# EAGLE design RetroBit (EAGLE 7.2.0)
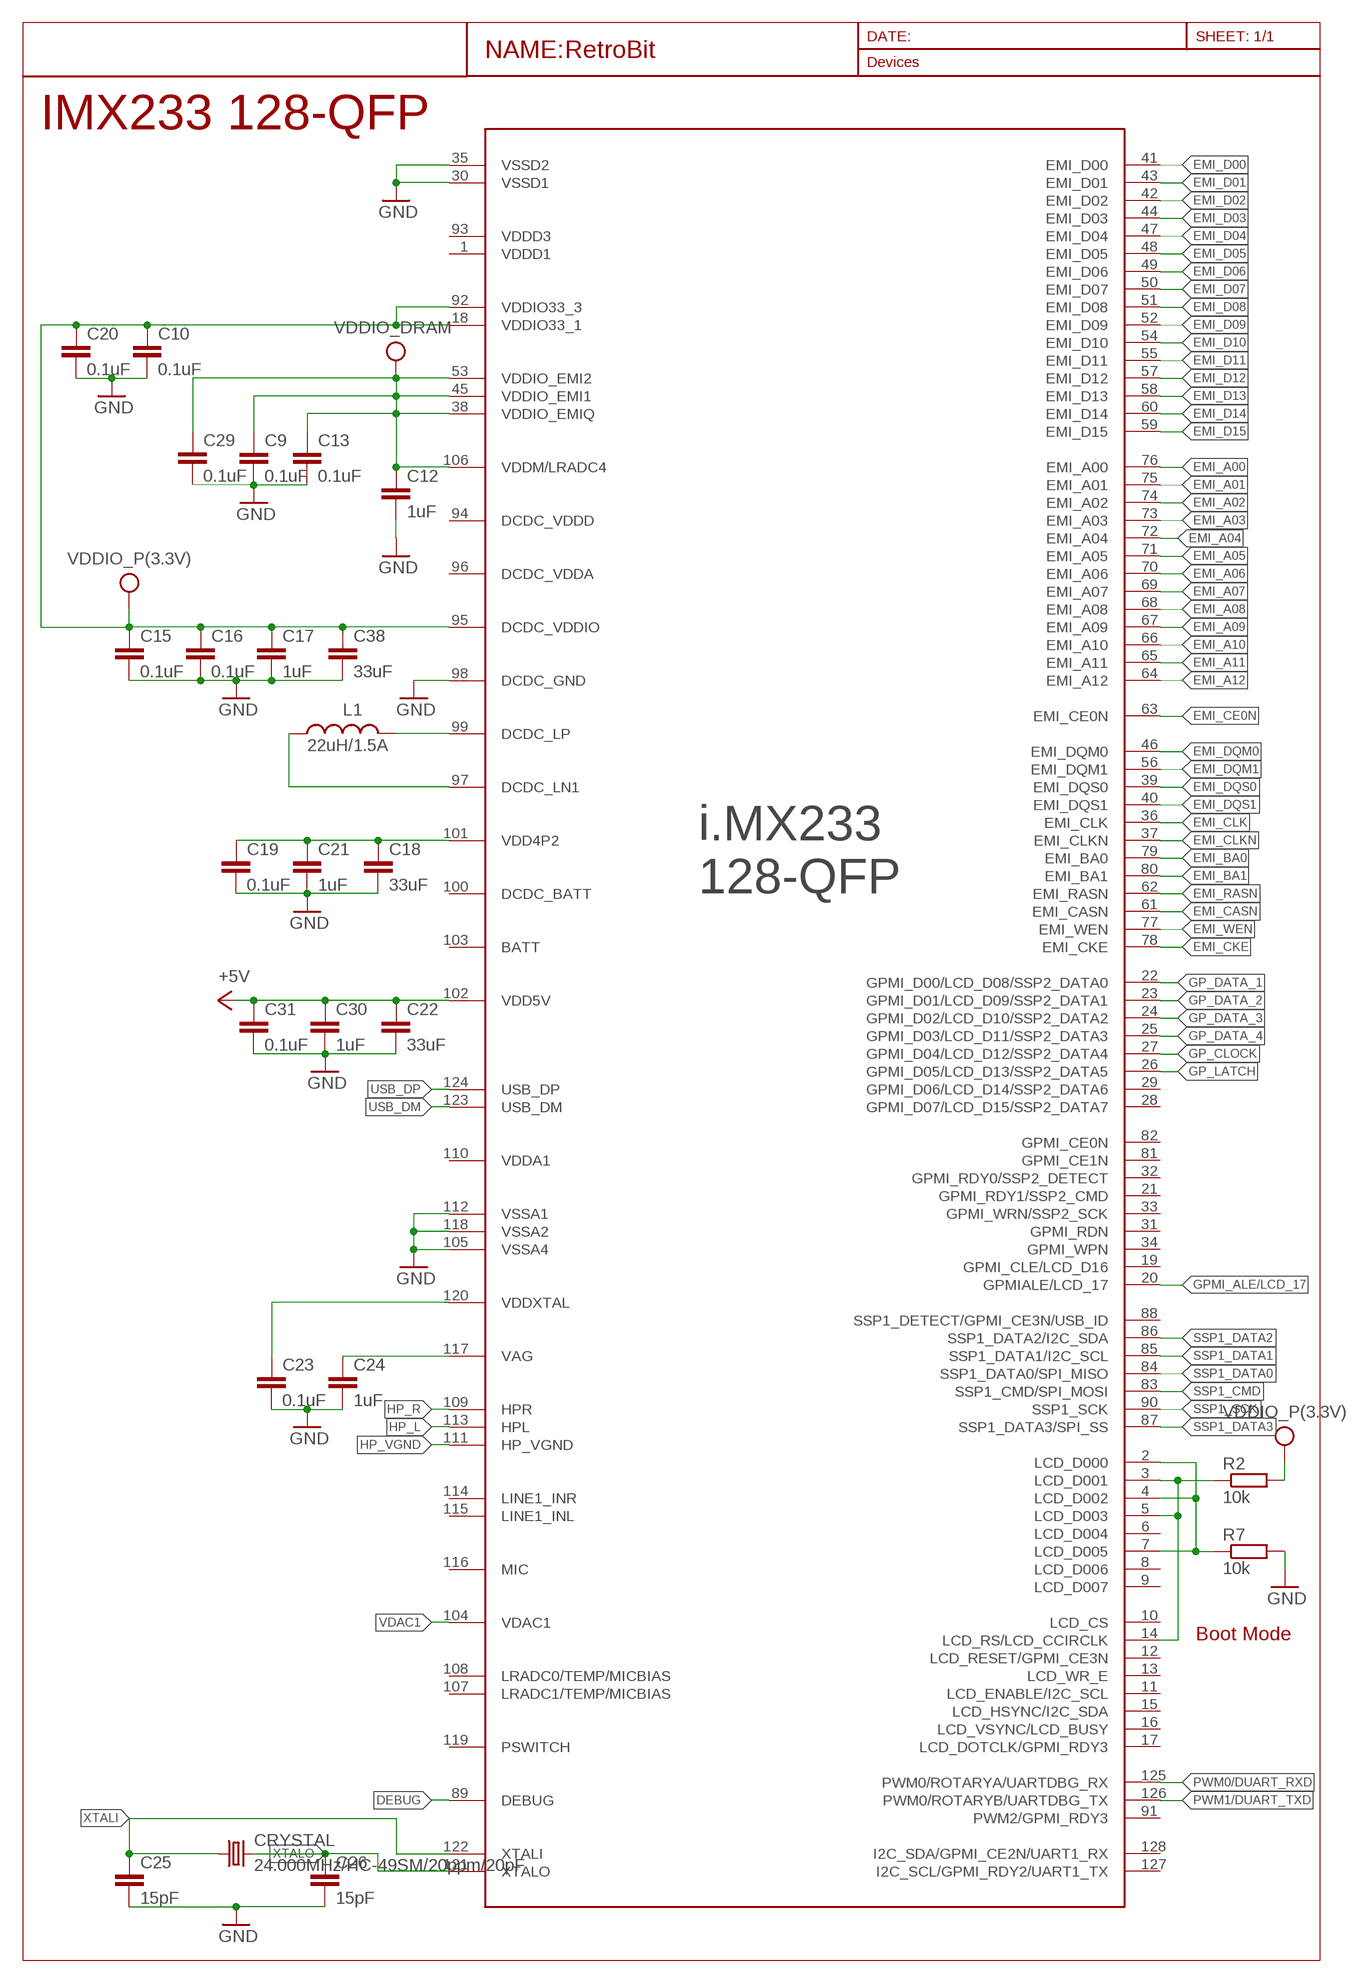
[diagram p0: schematic, sheet 1, part 1 of 2]
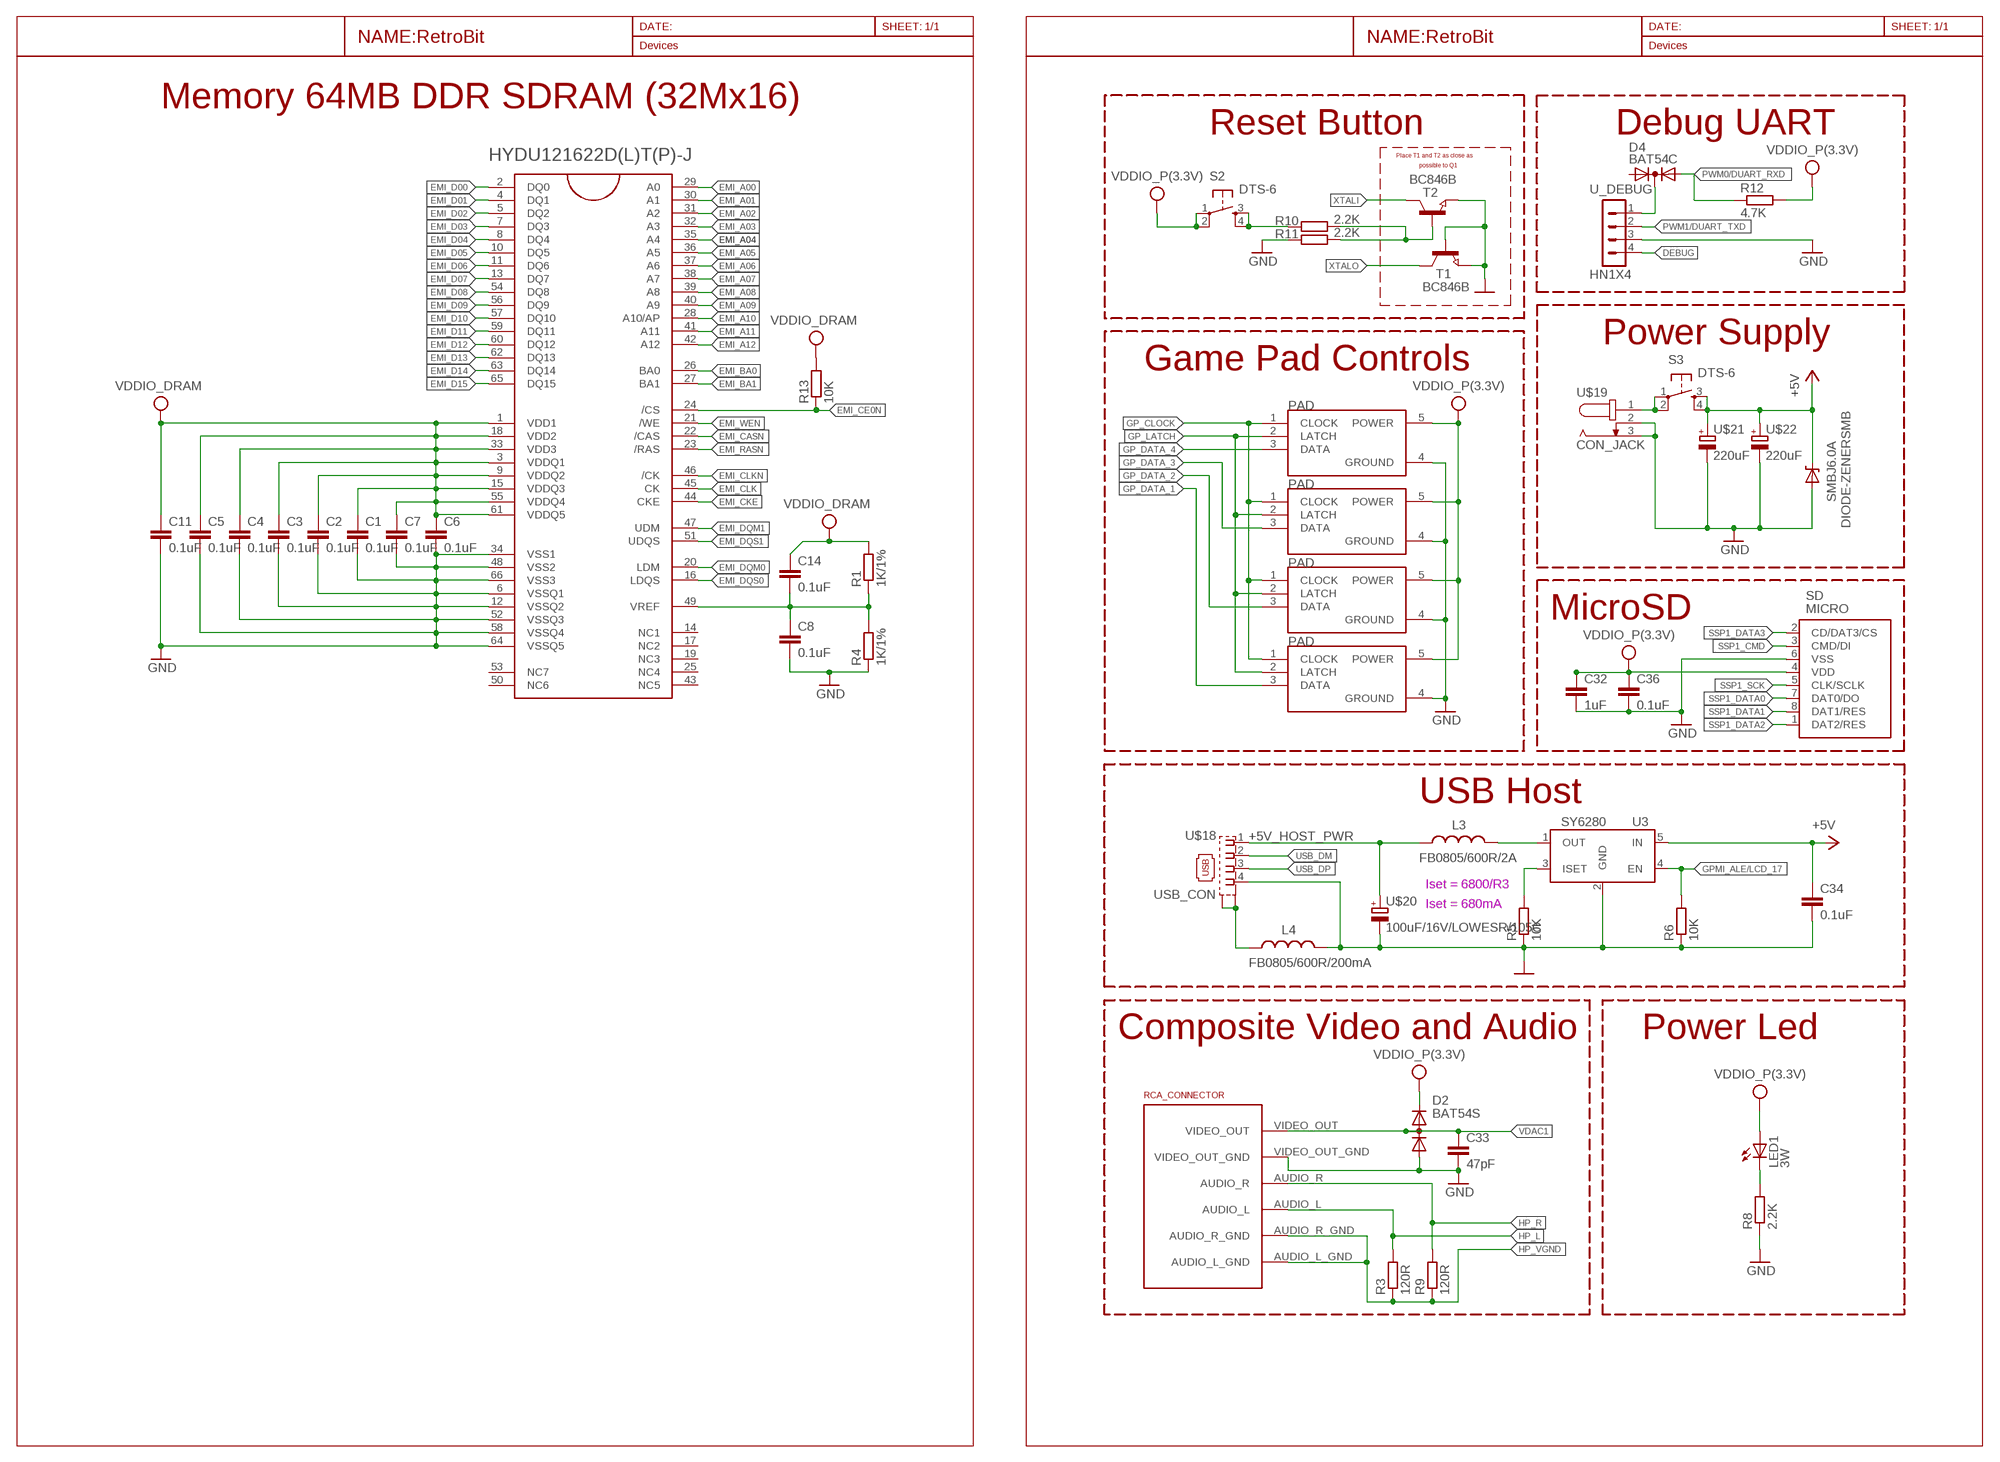
[diagram p1: schematic, sheet 1, part 2 of 2]

## Parts
C1  0.1uF  C-EUC0603K  [C0603K]
C2  0.1uF  C-EUC0603K  [C0603K]
C3  0.1uF  C-EUC0603K  [C0603K]
C4  0.1uF  C-EUC0603K  [C0603K]
C5  0.1uF  C-EUC0603K  [C0603K]
C6  0.1uF  C-EUC0603K  [C0603K]
C7  0.1uF  C-EUC0603K  [C0603K]
C8  0.1uF  C-EUC0603K  [C0603K]
C9  0.1uF  C-EUC0603K  [C0603K]
C10  0.1uF  C-EUC0603K  [C0603K]
C11  0.1uF  C-EUC0603K  [C0603K]
C12  1uF  C-EUC0805K  [C0805K]
C13  0.1uF  C-EUC0603K  [C0603K]
C14  0.1uF  C-EUC0603K  [C0603K]
C15  0.1uF  C-EUC0603K  [C0603K]
C16  0.1uF  C-EUC0603K  [C0603K]
C17  1uF  C-EUC0805K  [C0805K]
C18  33uF  C-EUC1210K  [C1210K]
C19  0.1uF  C-EUC0603K  [C0603K]
C20  0.1uF  C-EUC0603K  [C0603K]
C21  1uF  C-EUC0805K  [C0805K]
C22  33uF  C-EUC1210K  [C1210K]
C23  0.1uF  C-EUC0603K  [C0603K]
C24  1uF  C-EUC0805K  [C0805K]
C25  15pF  C-EUC0603K  [C0603K]
C26  15pF  C-EUC0603K  [C0603K]
C29  0.1uF  C-EUC0603K  [C0603K]
C30  1uF  C-EUC0805K  [C0805K]
C31  0.1uF  C-EUC0603K  [C0603K]
C32  1uF  C-EUC0805K  [C0805K]
C33  47pF  C-EUC0603K  [C0603K]
C34  0.1uF  C-EUC0603K  [C0603K]
C36  0.1uF  C-EUC0603K  [C0603K]
C38  33uF  C-EUC1210K  [C1210K]
CRYSTAL  24.000MHz/HC-49SM/20ppm/20pF  HC49U-V  [HC49U-V]
D2  BAT54S  DIODE_AC-AC_  [SOT23C(BAT54S)]
D4  BAT54C  DIODE_AC-CA_  [SOT23C]
IC1  MCIMX233CAG4C  [MCIMX233CAG4C]
L1  22uH/1.5A  INDUCTORCR75  [CR75]
L3  FB0805/600R/2A  INDUCTOR0805  [0805]
L4  FB0805/600R/200mA  INDUCTOR0805  [0805]
LED1  3W  LED3MM  [LED3MM]
R1  1K/1%  R-EU_R0603  [R0603]
R2  10k  R-EU_R0603  [R0603]
R3  120R  R-EU_R0805  [R0805]
R4  1K/1%  R-EU_R0603  [R0603]
R5  10K  R-EU_R0805  [R0805]
R6  10K  R-EU_R0805  [R0805]
R7  10k  R-EU_R0603  [R0603]
R8  2.2K  R-EU_R0805  [R0805]
R9  120R  R-EU_R0805  [R0805]
R10  2.2K  R-EU_R0805  [R0805]
R11  2.2K  R-EU_R0805  [R0805]
R12  4.7K  R-EU_R0805  [R0805]
R13  10K  R-EU_R0805  [R0805]
RCA_CONNECTOR  RCA_CONNECTOR  [RCA_CONNECTOR]
S2  DTS-6  [DTS-6]
S3  DTS-6  [DTS-6]
SD  MICRO  MICRO_SD/MMC  [TFR-MEM-CON]
SMBJ6.0A  DIODE-ZENERSMB  [SMB-DIODE]
T1  BC846B  NPN-TRANSISTOR_SOT23  [SOT23]
T2  BC846B  NPN-TRANSISTOR_SOT23  [SOT23]
U3  SY6280  [SOT23-5]
U$1  HY5DU121622D  [HYDU121622D(L)T(P)-J]
U$3  GAME_PAD  [GAME_PAD]
U$8  GAME_PAD  [GAME_PAD]
U$9  GAME_PAD  [GAME_PAD]
U$14  GAME_PAD  [GAME_PAD]
U$18  USB_CON  [USB_CON]
U$19  CON_JACK  [CON_JACK]
U$20  100uF/16V/LOWESR/105C  CPOL-EVE2.5-6.3  [CPOL-EVE-2.5,6-3]
U$21  220uF  CPOL-EVE2.5-6.3  [CPOL-EVE-2.5,6-3]
U$22  220uF  CPOL-EVE2.5-6.3  [CPOL-EVE-2.5,6-3]
U_DEBUG  HN1X4  CON4HN1X4  [HN1X4]

## Nets
+5V: C22.1 C30.1 C31.1 C34.1 IC1.102(VDD5V) S3.3 S3.4 SMBJ6.0A.C U3.5(IN) U$21.+ U$22.+
+5V_HOST_PWR: L3.1 U$18.1 U$20.+
DEBUG: IC1.89(DEBUG) U_DEBUG.4
EMI_A00: IC1.76(EMI_A00) U$1.29(A0)
EMI_A01: IC1.75(EMI_A01) U$1.30(A1)
EMI_A02: IC1.74(EMI_A02) U$1.31(A2)
EMI_A03: IC1.73(EMI_A03) U$1.32(A3)
EMI_A04: IC1.72(EMI_A04) U$1.35(A4)
EMI_A05: IC1.71(EMI_A05) U$1.36(A5)
EMI_A06: IC1.70(EMI_A06) U$1.37(A6)
EMI_A07: IC1.69(EMI_A07) U$1.38(A7)
EMI_A08: IC1.68(EMI_A08) U$1.39(A8)
EMI_A09: IC1.67(EMI_A09) U$1.40(A9)
EMI_A10: IC1.66(EMI_A10) U$1.28(A10/AP)
EMI_A11: IC1.65(EMI_A11) U$1.41(A11)
EMI_A12: IC1.64(EMI_A12) U$1.42(A12)
EMI_BA0: IC1.79(EMI_BA0) U$1.26(BA0)
EMI_BA1: IC1.80(EMI_BA1) U$1.27(BA1)
EMI_CASN: IC1.61(EMI_CASN) U$1.22(/CAS)
EMI_CE0N: IC1.63(EMI_CE0N) R13.1 U$1.24(/CS)
EMI_CKE: IC1.78(EMI_CKE) U$1.44(CKE)
EMI_CLK: IC1.36(EMI_CLK) U$1.45(CK)
EMI_CLKN: IC1.37(EMI_CLKN) U$1.46(/CK)
EMI_D00: IC1.41(EMI_D00) U$1.2(DQ0)
EMI_D01: IC1.43(EMI_D01) U$1.4(DQ1)
EMI_D02: IC1.42(EMI_D02) U$1.5(DQ2)
EMI_D03: IC1.44(EMI_D03) U$1.7(DQ3)
EMI_D04: IC1.47(EMI_D04) U$1.8(DQ4)
EMI_D05: IC1.48(EMI_D05) U$1.10(DQ5)
EMI_D06: IC1.49(EMI_D06) U$1.11(DQ6)
EMI_D07: IC1.50(EMI_D07) U$1.13(DQ7)
EMI_D08: IC1.51(EMI_D08) U$1.54(DQ8)
EMI_D09: IC1.52(EMI_D09) U$1.56(DQ9)
EMI_D10: IC1.54(EMI_D10) U$1.57(DQ10)
EMI_D11: IC1.55(EMI_D11) U$1.59(DQ11)
EMI_D12: IC1.57(EMI_D12) U$1.60(DQ12)
EMI_D13: IC1.58(EMI_D13) U$1.62(DQ13)
EMI_D14: IC1.60(EMI_D14) U$1.63(DQ14)
EMI_D15: IC1.59(EMI_D15) U$1.65(DQ15)
EMI_DQM0: IC1.46(EMI_DQM0) U$1.20(LDM)
EMI_DQM1: IC1.56(EMI_DQM1) U$1.47(UDM)
EMI_DQS0: IC1.39(EMI_DQS0) U$1.16(LDQS)
EMI_DQS1: IC1.40(EMI_DQS1) U$1.51(UDQS)
EMI_RASN: IC1.62(EMI_RASN) U$1.23(/RAS)
EMI_WEN: IC1.77(EMI_WEN) U$1.21(/WE)
GND: C1.2 C2.2 C3.2 C4.2 C5.2 C6.2 C7.2 C8.2 C9.2 C10.2 C11.2 C12.2 C13.2 C15.2 C16.2 C17.2 C18.2 C19.2 C20.2 C21.2 C22.2 C23.2 C24.2 C25.2 C26.2 C29.2 C30.2 C31.2 C32.2 C33.2 C34.2 C36.2 C38.2 D2.1(A) IC1.30(VSSD1) IC1.35(VSSD2) IC1.98(DCDC_GND) IC1.105(VSSA4) IC1.112(VSSA1) IC1.118(VSSA2) L4.2 R4.1 R5.1 R6.1 R7.2 R8.1 R11.1 RCA_CONNECTOR.VIDEO_OUT_GND SD.6(VSS) SMBJ6.0A.A T1.1(B) T1.2(E) T2.2(E) U3.2(GND) U$1.6(VSSQ1) U$1.12(VSSQ2) U$1.34(VSS1) U$1.48(VSS2) U$1.52(VSSQ3) U$1.58(VSSQ4) U$1.64(VSSQ5) U$1.66(VSS3) U$3.4(GROUND) U$8.4(GROUND) U$9.4(GROUND) U$14.4(GROUND) U$18.4 U$19.2 U$19.3 U$20.- U$21.- U$22.- U_DEBUG.3
GP_CLOCK: IC1.27(GPMI_D04/LCD_D12/SSP2_DATA4) U$3.1(CLOCK) U$8.1(CLOCK) U$9.1(CLOCK) U$14.1(CLOCK)
GP_DATA_1: IC1.22(GPMI_D00/LCD_D08/SSP2_DATA0) U$14.3(DATA)
GP_DATA_2: IC1.23(GPMI_D01/LCD_D09/SSP2_DATA1) U$9.3(DATA)
GP_DATA_3: IC1.24(GPMI_D02/LCD_D10/SSP2_DATA2) U$8.3(DATA)
GP_DATA_4: IC1.25(GPMI_D03/LCD_D11/SSP2_DATA3) U$3.3(DATA)
GP_LATCH: IC1.26(GPMI_D05/LCD_D13/SSP2_DATA5) U$3.2(LATCH) U$8.2(LATCH) U$9.2(LATCH) U$14.2(LATCH)
GPMI_ALE/LCD_17: IC1.20(GPMIALE/LCD_17) R6.2 U3.4(EN)
HP_L: IC1.113(HPL) R3.2 RCA_CONNECTOR.AUDIO_L
HP_R: IC1.109(HPR) R9.2 RCA_CONNECTOR.AUDIO_R
HP_VGND: IC1.111(HP_VGND) R3.1 R9.1 RCA_CONNECTOR.AUDIO_L_GND RCA_CONNECTOR.AUDIO_R_GND
N$1: D4.3(K) U_DEBUG.1
N$2: C8.1 C14.2 R1.1 R4.2 U$1.49(VREF)
N$3: S3.1 S3.2 U$19.1
N$5: C18.1 C19.1 C21.1 IC1.101(VDD4P2)
N$6: IC1.99(DCDC_LP) L1.P$2
N$7: IC1.3(LCD_D001) IC1.5(LCD_D003) IC1.14(LCD_RS/LCD_CCIRCLK) R2.1
N$8: IC1.97(DCDC_LN1) L1.P$1
N$9: R5.2 U3.3(ISET)
N$10: C23.1 IC1.120(VDDXTAL)
N$11: L3.2 U3.1(OUT)
N$12: L4.1 U$18.M1(S1) U$18.M2(S2)
N$13: C24.1 IC1.117(VAG)
N$14: IC1.2(LCD_D000) IC1.4(LCD_D002) IC1.7(LCD_D005) R7.1
N$15: LED1.K(C) R8.2
N$17: R10.1 S2.3 S2.4
N$43: R10.2 R11.2 T2.1(B)
PWM0/DUART_RXD: D4.2(A2) IC1.125(PWM0/ROTARYA/UARTDBG_RX) R12.1
PWM1/DUART_TXD: IC1.126(PWM0/ROTARYB/UARTDBG_TX) U_DEBUG.2
SSP1_CMD: IC1.83(SSP1_CMD/SPI_MOSI) SD.3(CMD/DI)
SSP1_DATA0: IC1.84(SSP1_DATA0/SPI_MISO) SD.7(DAT0/DO)
SSP1_DATA1: IC1.85(SSP1_DATA1/I2C_SCL) SD.8(DAT1/RES)
SSP1_DATA2: IC1.86(SSP1_DATA2/I2C_SDA) SD.1(DAT2/RES)
SSP1_DATA3: IC1.87(SSP1_DATA3/SPI_SS) SD.2(CD/DAT3/CS)
SSP1_SCK: IC1.90(SSP1_SCK) SD.5(CLK/SCLK)
USB_DM: IC1.123(USB_DM) U$18.2
USB_DP: IC1.124(USB_DP) U$18.3
VDAC1: C33.1 D2.3(AK) IC1.104(VDAC1) RCA_CONNECTOR.VIDEO_OUT
VDDIO_DRAM: C1.1 C2.1 C3.1 C4.1 C5.1 C6.1 C7.1 C9.1 C11.1 C12.1 C13.1 C14.1 C29.1 IC1.38(VDDIO_EMIQ) IC1.45(VDDIO_EMI1) IC1.53(VDDIO_EMI2) IC1.106(VDDM/LRADC4) R1.2 R13.2 U$1.1(VDD1) U$1.3(VDDQ1) U$1.9(VDDQ2) U$1.15(VDDQ3) U$1.18(VDD2) U$1.33(VDD3) U$1.55(VDDQ4) U$1.61(VDDQ5)
VDDIO_P(3.3V): C10.1 C15.1 C16.1 C17.1 C20.1 C32.1 C36.1 C38.1 D2.2(K) IC1.18(VDDIO33_1) IC1.92(VDDIO33_3) IC1.95(DCDC_VDDIO) LED1.A R2.2 R12.2 S2.1 S2.2 SD.4(VDD) U$3.5(POWER) U$8.5(POWER) U$9.5(POWER) U$14.5(POWER)
XTALI: C25.1 CRYSTAL.1 IC1.122(XTALI) T2.3(C)
XTALO: C26.1 CRYSTAL.2 IC1.121(XTALO) T1.3(C)
Unconnected: D4.1(A1) IC1.1(VDDD1) IC1.6(LCD_D004) IC1.8(LCD_D006) IC1.9(LCD_D007) IC1.10(LCD_CS) IC1.11(LCD_ENABLE/I2C_SCL) IC1.12(LCD_RESET/GPMI_CE3N) IC1.13(LCD_WR_E) IC1.15(LCD_HSYNC/I2C_SDA) IC1.16(LCD_VSYNC/LCD_BUSY) IC1.17(LCD_DOTCLK/GPMI_RDY3) IC1.19(GPMI_CLE/LCD_D16) IC1.21(GPMI_RDY1/SSP2_CMD) IC1.28(GPMI_D07/LCD_D15/SSP2_DATA7) IC1.29(GPMI_D06/LCD_D14/SSP2_DATA6) IC1.31(GPMI_RDN) IC1.32(GPMI_RDY0/SSP2_DETECT) IC1.33(GPMI_WRN/SSP2_SCK) IC1.34(GPMI_WPN) IC1.81(GPMI_CE1N) IC1.82(GPMI_CE0N) IC1.88(SSP1_DETECT/GPMI_CE3N/USB_ID) IC1.91(PWM2/GPMI_RDY3) IC1.93(VDDD3) IC1.94(DCDC_VDDD) IC1.96(DCDC_VDDA) IC1.100(DCDC_BATT) IC1.103(BATT) IC1.107(LRADC1/TEMP/MICBIAS) IC1.108(LRADC0/TEMP/MICBIAS) IC1.110(VDDA1) IC1.114(LINE1_INR) IC1.115(LINE1_INL) IC1.116(MIC) IC1.119(PSWITCH) IC1.127(I2C_SCL/GPMI_RDY2/UART1_TX) IC1.128(I2C_SDA/GPMI_CE2N/UART1_RX) U$1.14(NC1) U$1.17(NC2) U$1.19(NC3) U$1.25(NC4) U$1.43(NC5) U$1.50(NC6) U$1.53(NC7)

## Notes on the sheet
- IMX233 128-QFP
- Memory 64MB DDR SDRAM (32Mx16)
- Reset Button | Debug UART
- Place T1 and T2 as close as
- possible to Q1
- Power Supply
- Game Pad Controls
- MicroSD
- USB Host
- Iset = 6800/R3
- Iset = 680mA
- Composite Video and Audio | Power Led
- Boot Mode

## Library data of the parts
C1-C26 C29-C34 C36 C38 = rcl:C-EU: CAPACITOR, European symbol
CRYSTAL = RetroBit:HC49U-V
D2 = semicon-smd-ipc:DIODE_AC-AC_: DUAL DIODE
D4 = semicon-smd-ipc:DIODE_AC-CA_: DUAL DIODE
IC1 = RetroBit:MCIMX233CAG4C: i.MX233 microescale
L1 L3 L4 = SparkFun-Passives:INDUCTOR: Inductors Basic Inductor/Choke - 0603 and 1206. Footprints are not proven and vary greatly between part numbers.
LED1 = led:LED: LED OSRAM: - CHIPLED LG R971, LG N971, LY N971, LG Q971, LY Q971, LO R971, LY R971 LH N974, LH R974 LS Q976, LO Q976, LY Q976 LO Q996 - Hyper CHIPLED LW Q18S LB Q993, LB Q99A, LB R99A - SideLED LS A670, LO A670, LY A670, LG A670, LP A670 LB A673, LV A673, LT A673, LW A673 LH A674 LY A675 LS A676, LA A676, LO A676, LY A676, LW A676 LS A679, LY A679, LG A679 - Hyper Micro SIDELED® LS Y876, LA Y876, LO Y876, LY Y876 LT Y87S - SmartLED LW L88C, LW L88S LB L89C, LB L89S, LG L890 LS L89K, LO L89K, LY L89K LS L896, LA L896, LO L896, LY L896 - TOPLED LS T670, LO T670, LY T670, LG T670, LP T670 LSG T670, LSP T670, LSY T670, LOP T670, LYG T670 LG T671, LOG T671, LSG T671 LB T673, LV T673, LT T673, LW T673 LH T674 LS T676, LA T676, LO T676, LY T676, LB T676, LH T676, LSB T676, LW T676 LB T67C, LV T67C, LT T67C, LS T67K, LO T67K, LY T67K, LW E67C LS E67B, LA E67B, LO E67B, LY E67B, LB E67C, LV E67C, LT E67C LW T67C LS T679, LY T679, LG T679 LS T770, LO T770, LY T770, LG T770, LP T770 LB T773, LV T773, LT T773, LW T773 LH T774 LS E675, LA E675, LY E675, LS T675 LS T776, LA T776, LO T776, LY T776, LB T776 LHGB T686 LT T68C, LB T68C - Hyper Mini TOPLED® LB M676 - Mini TOPLED Santana® LG M470 LS M47K, LO M47K, LY M47K Source: http://www.osram.convergy.de LUXEON: - LUMILED® LXK2-PW12-R00, LXK2-PW12-S00, LXK2-PW14-U00, LXK2-PW14-V00 LXK2-PM12-R00, LXK2-PM12-S00, LXK2-PM14-U00 LXK2-PE12-Q00, LXK2-PE12-R00, LXK2-PE12-S00, LXK2-PE14-T00, LXK2-PE14-U00 LXK2-PB12-K00, LXK2-PB12-L00, LXK2-PB12-M00, LXK2-PB14-N00, LXK2-PB14-P00, LXK2-PB14-Q00 LXK2-PR12-L00, LXK2-PR12-M00, LXK2-PR14-Q00, LXK2-PR14-R00 LXK2-PD12-Q00, LXK2-PD12-R00, LXK2-PD12-S00 LXK2-PH12-R00, LXK2-PH12-S00 LXK2-PL12-P00, LXK2-PL12-Q00, LXK2-PL12-R00 Source: www.luxeon.com KINGBRIGHT: KA-3528ASYC Source: www.kingbright.com
R1-R13 = rcl:R-EU_: RESISTOR, European symbol
RCA_CONNECTOR = RetroBit:RCA_CONNECTOR
S2 S3 = switch-tact:DTS-6
SD = OLIMEX_CONNECTORS:MICRO_SD/MMC
SMBJ6.0A = SparkFun-DiscreteSemi:DIODE-ZENER: Zener Diode Production Part - 8199 3.4V Zener Voltage
T1 T2 = semicon-smd-ipc:NPN-TRANSISTOR_: NPN TRANSISTOR
U3 = OLIMEX_IC:SY6280
U$1 = RetroBit:HY5DU121622D
U$3 U$8 U$9 U$14 = RetroBit:GAME_PAD
U$18 = RetroBit:USB_CON
U$19 = RetroBit:CON_JACK
U$20-U$22 = RetroBit:CPOL-EVE2.5-6.3
U_DEBUG = Penko:CON4

## Net classes
1 PWR: width 0.203 mm, drill 0.4 mm, clearance 0.076 mm

## Board
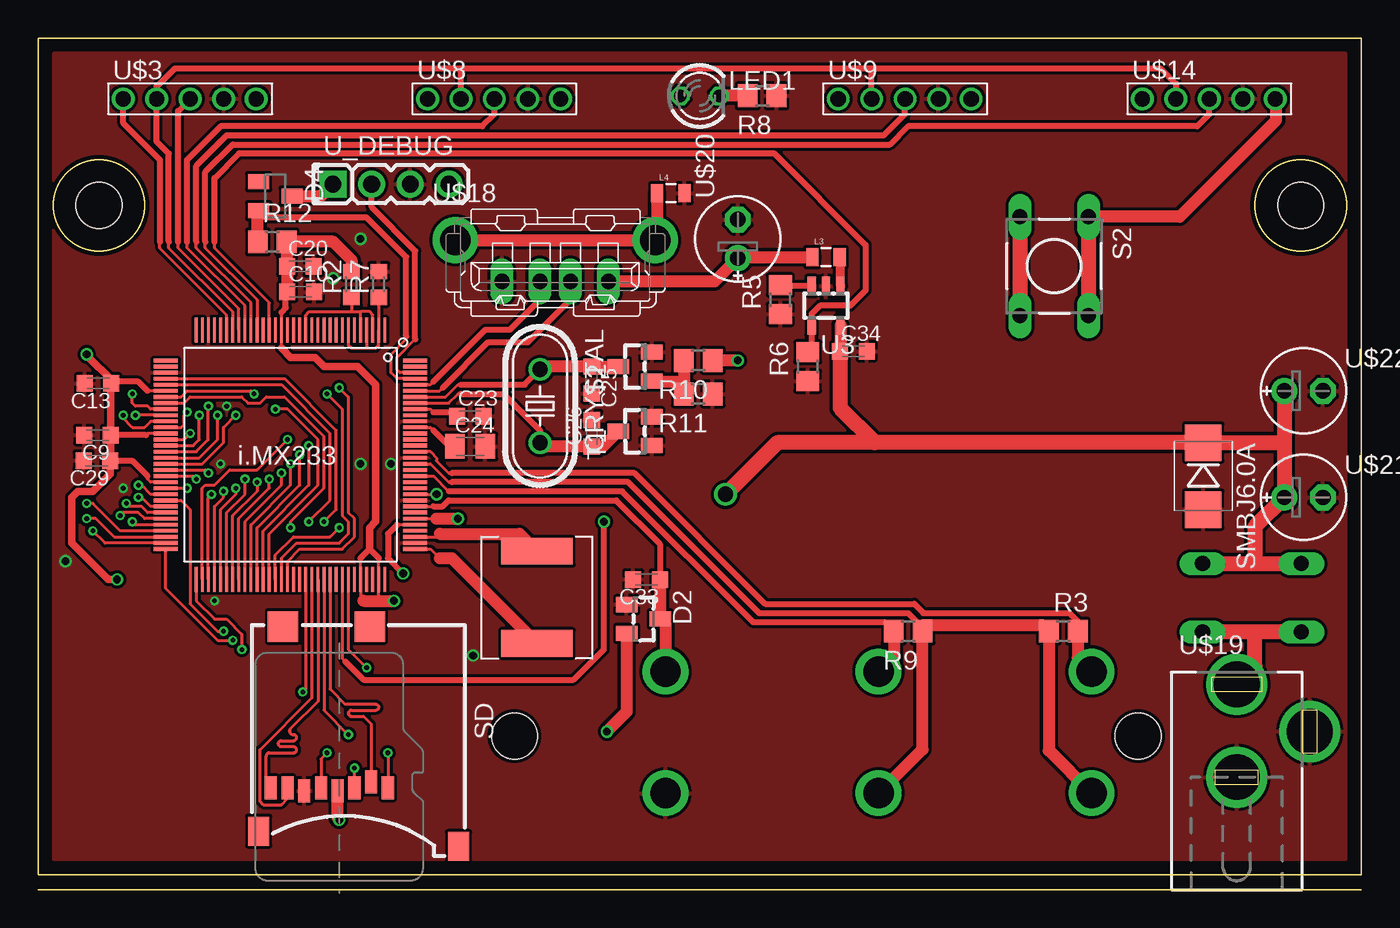
[diagram p2: board, top side]
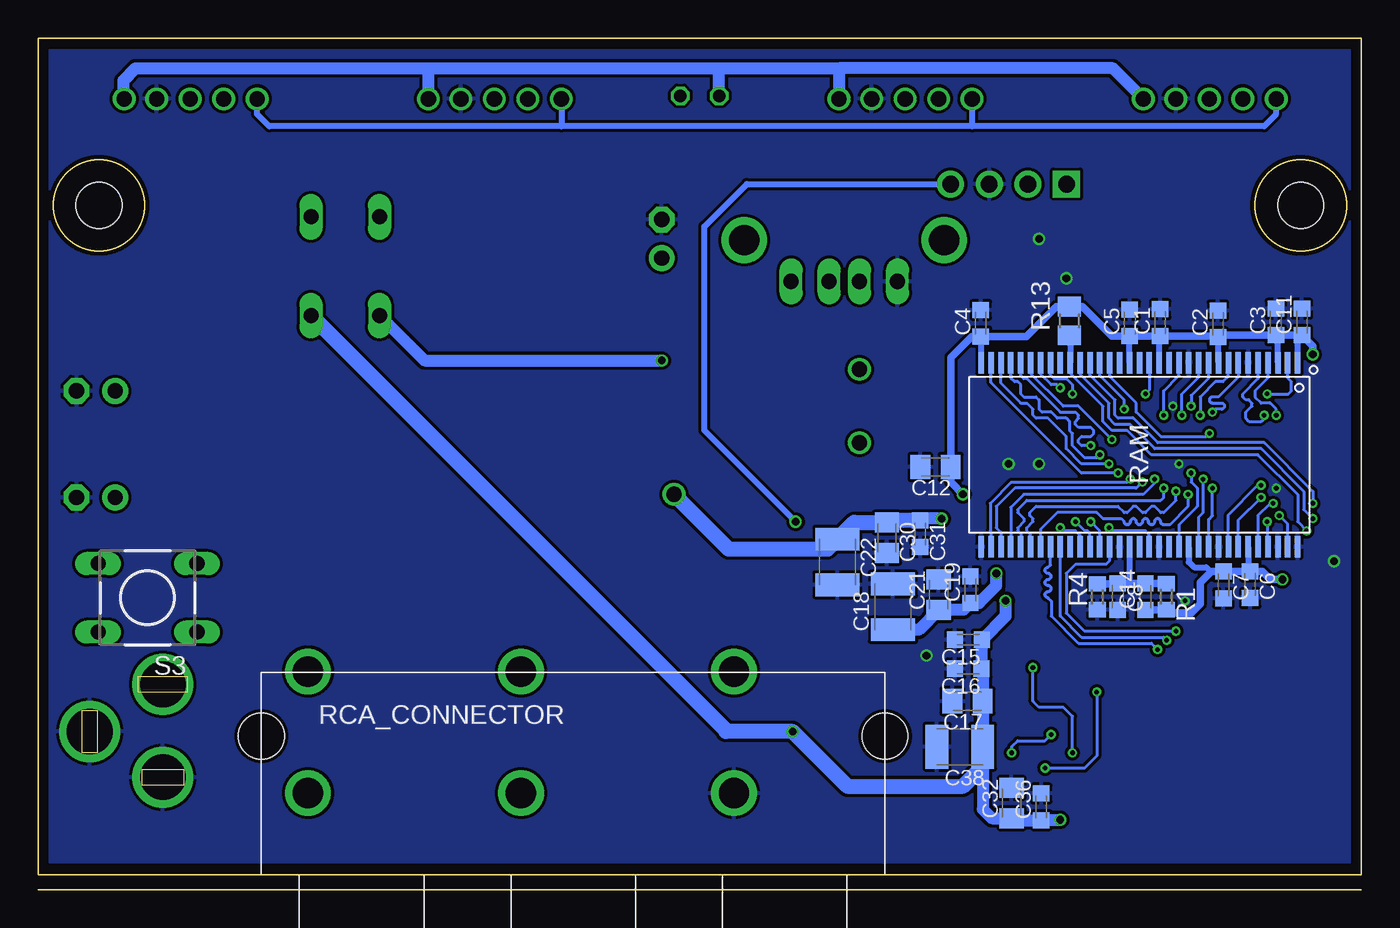
[diagram p3: board, bottom side, seen from below]

Size 87 x 56 mm. Coordinates in mm from the lower left corner, seen from the top.
Outline: 0,0 87,0
Outline: 0,1 87,1 87,56 0,56 0,1
Outline: circle at 4,45 radius 3
Outline: circle at 83,45 radius 3
Copper layers (1*16): Top 0.035mm / dielectric 0.2mm / Bottom 0.035mm
Design rules "default *": minimum track width 0.2mm, minimum drill 0.3mm, track to track 0.2mm, track to pad 0.2mm, pad to pad 0.2mm, via to via 0.2mm, smd to smd 1mil, copper to edge 10mil, drill to drill 8mil, minimum pad ring 6mil, minimum via ring 0.15mm, stop-mask expansion 4mil, vias tented up to drill 24mil, thermal gap 0.2mm
Holes 3 mm at 4,45 83,45

### Footprints (pad centres in the part's own frame; a part is rotated, then mirrored left to right if it is on the bottom)
C0603K = smd 1.05 x 1.08: 1 -0.875,0; 2 0.875,0
C0805K = smd 1.3 x 1.6: 1 -1,0; 2 1,0
C1210K = smd 1.5 x 2.9: 1 -1.5,0; 2 1.5,0
HC49U-V = drill 1: 1 -2.413,0; 2 2.413,0
SOT23C(BAT54S) = smd 1 x 1.4: 1 -0.95,-1.1; 2 0.95,-1.1; 3 0,1.1
SOT23C = smd 1 x 1.4: 1 -0.95,-1.1; 2 0.95,-1.1; 3 0,1.1
MCIMX233CAG4C = smd 0.2 x 1.6: 1 -6.2,-8.2; 2 -5.8,-8.2; 3 -5.4,-8.2; 4 -5,-8.2; 5 -4.6,-8.2; 6 -4.2,-8.2; 7 -3.8,-8.2; 8 -3.4,-8.2; 9 -3,-8.2; 10 -2.6,-8.2; 11 -2.2,-8.2; 12 -1.8,-8.2; 13 -1.4,-8.2; 14 -1,-8.2; 15 -0.6,-8.2; 16 -0.2,-8.2; 17 0.2,-8.2; 18 0.6,-8.2; 19 1,-8.2; 20 1.4,-8.2; 21 1.8,-8.2; 22 2.2,-8.2; 23 2.6,-8.2; 24 3,-8.2; 25 3.4,-8.2; 26 3.8,-8.2; 27 4.2,-8.2; 28 4.6,-8.2; 29 5,-8.2; 30 5.4,-8.2; 31 5.8,-8.2; 32 6.2,-8.2; 65 6.2,8.2; 66 5.8,8.2; 67 5.4,8.2; 68 5,8.2; 69 4.6,8.2; 70 4.2,8.2; 71 3.8,8.2; 72 3.4,8.2; 73 3,8.2; 74 2.6,8.2; 75 2.2,8.2; 76 1.8,8.2; 77 1.4,8.2; 78 1,8.2; 79 0.6,8.2; 80 0.2,8.2; 81 -0.2,8.2; 82 -0.6,8.2; 83 -1,8.2; 84 -1.4,8.2; 85 -1.8,8.2; 86 -2.2,8.2; 87 -2.6,8.2; 88 -3,8.2; 89 -3.4,8.2; 90 -3.8,8.2; 91 -4.2,8.2; 92 -4.6,8.2; 93 -5,8.2; 94 -5.4,8.2; 95 -5.8,8.2; 96 -6.2,8.2 | smd 1.6 x 0.2: 33 8.2,-6.2; 34 8.2,-5.8; 35 8.2,-5.4; 36 8.2,-5; 37 8.2,-4.6; 38 8.2,-4.2; 39 8.2,-3.8; 40 8.2,-3.4; 41 8.2,-3; 42 8.2,-2.6; 43 8.2,-2.2; 44 8.2,-1.8; 45 8.2,-1.4; 46 8.2,-1; 47 8.2,-0.6; 48 8.2,-0.2; 49 8.2,0.2; 50 8.2,0.6; 51 8.2,1; 52 8.2,1.4; 53 8.2,1.8; 54 8.2,2.2; 55 8.2,2.6; 56 8.2,3; 57 8.2,3.4; 58 8.2,3.8; 59 8.2,4.2; 60 8.2,4.6; 61 8.2,5; 62 8.2,5.4; 63 8.2,5.8; 64 8.2,6.2; 97 -8.2,6.2; 98 -8.2,5.8; 99 -8.2,5.4; 100 -8.2,5; 101 -8.2,4.6; 102 -8.2,4.2; 103 -8.2,3.8; 104 -8.2,3.4; 105 -8.2,3; 106 -8.2,2.6; 107 -8.2,2.2; 108 -8.2,1.8; 109 -8.2,1.4; 110 -8.2,1; 111 -8.2,0.6; 112 -8.2,0.2; 113 -8.2,-0.2; 114 -8.2,-0.6; 115 -8.2,-1; 116 -8.2,-1.4; 117 -8.2,-1.8; 118 -8.2,-2.2; 119 -8.2,-2.6; 120 -8.2,-3; 121 -8.2,-3.4; 122 -8.2,-3.8; 123 -8.2,-4.2; 124 -8.2,-4.6; 125 -8.2,-5; 126 -8.2,-5.4; 127 -8.2,-5.8; 128 -8.2,-6.2
CR75 = smd 1.75 x 4.7: P$1 0,0; P$2 6.05,0
0805 = smd 0.8 x 1.2: 1 -0.9,0; 2 0.9,0
LED3MM = drill 0.813 octagon: A -1.27,0; K 1.27,0
R0603 = smd 1 x 1.1: 1 -0.85,0; 2 0.85,0
R0805 = smd 1.3 x 1.5: 1 -0.95,0; 2 0.95,0
RCA_CONNECTOR = drill 2: AUDIO_L -17.25,7; AUDIO_L_GND -17.25,-1; AUDIO_R -3.25,7; AUDIO_R_GND -3.25,-1; VIDEO_OUT 10.75,7; VIDEO_OUT_GND 10.75,-1 | hole 3: -20.32,2.75; 20.68,2.75
DTS-6 = drill 1 long: 1 -3.25,2.25; 2 3.25,2.25; 3 -3.25,-2.25; 4 3.25,-2.25
TFR-MEM-CON = smd 0.8 x 1.5: 1 -3.2,10.7; 2 -2.1,10.3; 3 -1,10.7; 4 0.1,10.9; 5 1.2,10.7; 6 2.3,10.9; 7 3.4,10.7; 8 4.5,10.7 | smd 2 x 2: 9 3.7,0.1; 10 -2,0.1 | smd 1.4 x 1.9: 11 5.3,13.55; 12 -7.85,14.55
SMB-DIODE = smd 2.4 x 2.4: A 2.2,0; C -2.2,0
SOT23 = smd 1 x 1.4: 1 -0.95,-1.1; 2 0.95,-1.1; 3 0,1.1
SOT23-5 = smd 0.55 x 1.2: 1 -0.95,-1.3; 2 0,-1.3; 3 0.95,-1.3; 4 0.95,1.3; 5 -0.95,1.3
HYDU121622D(L)T(P)-J = smd 1.4 x 0.4: 1 6.05,-10.4; 2 6.05,-9.75; 3 6.05,-9.1; 4 6.05,-8.45; 5 6.05,-7.8; 6 6.05,-7.15; 7 6.05,-6.5; 8 6.05,-5.85; 9 6.05,-5.2; 10 6.05,-4.55; 11 6.05,-3.9; 12 6.05,-3.25; 13 6.05,-2.6; 14 6.05,-1.95; 15 6.05,-1.3; 16 6.05,-0.65; 17 6.05,0; 18 6.05,0.65; 19 6.05,1.3; 20 6.05,1.95; 21 6.05,2.6; 22 6.05,3.25; 23 6.05,3.9; 24 6.05,4.55; 25 6.05,5.2; 26 6.05,5.85; 27 6.05,6.5; 28 6.05,7.15; 29 6.05,7.8; 30 6.05,8.45; 31 6.05,9.1; 32 6.05,9.75; 33 6.05,10.4; 34 -6.05,10.4; 35 -6.05,9.75; 36 -6.05,9.1; 37 -6.05,8.45; 38 -6.05,7.8; 39 -6.05,7.15; 40 -6.05,6.5; 41 -6.05,5.85; 42 -6.05,5.2; 43 -6.05,4.55; 44 -6.05,3.9; 45 -6.05,3.25; 46 -6.05,2.6; 47 -6.05,1.95; 48 -6.05,1.3; 49 -6.05,0.65; 50 -6.05,0; 51 -6.05,-0.65; 52 -6.05,-1.3; 53 -6.05,-1.95; 54 -6.05,-2.6; 55 -6.05,-3.25; 56 -6.05,-3.9; 57 -6.05,-4.55; 58 -6.05,-5.2; 59 -6.05,-5.85; 60 -6.05,-6.5; 61 -6.05,-7.15; 62 -6.05,-7.8; 63 -6.05,-8.45; 64 -6.05,-9.1; 65 -6.05,-9.75; 66 -6.05,-10.4
GAME_PAD = drill 1: 1 -4.4,0; 2 -2.2,0; 3 0,0; 4 2.2,0; 5 4.34,0
USB_CON = drill 1 long: 1 3.5,-1; 2 1,-1; 3 -1,-1; 4 -3.5,-1 | drill 2: M1 -6.57,1.71; M2 6.57,1.71
CON_JACK = drill 3: 1 0,3.1; 2 4.8,0; 3 0,-3
CPOL-EVE-2.5,6-3 = drill 1 pad 1.7: + -1.27,0 | drill 1 pad 1.7 octagon: - 1.27,0
HN1X4 = drill 1.1 pad 1.778 square: 1 -3.81,0 | drill 1.1 pad 1.778: 2 -1.27,0; 3 1.27,0; 4 3.81,0

### Placement (x,y rotation side)
C1  13.23,37.29 90 bottom
C2  9.43,37.21 90 bottom
C3  5.63,37.33 90 bottom
C4  25.03,37.25 90 bottom
C5  15.23,37.27 90 bottom
C6  7.32,20.06 270 bottom
C7  9.07,20.04 270 bottom
C8  16.02,19.27 270 bottom
C9  3.91,29.89 180 top
C10  17.26,39.31 0 top
C11  3.91,37.33 90 bottom
C12  28,27.8 180 bottom
C13  3.95,33.29 180 top
C14  14.21,19.27 90 bottom
C15  25.84,16.44 180 bottom
C16  25.84,14.53 180 bottom
C17  25.9,12.4 180 bottom
C18  30.8,18.6 90 bottom
C19  25.71,19.73 90 bottom
C20  17.24,40.99 0 top
C21  27.8,19.4 90 bottom
C22  34.45,21.55 270 bottom
C23  28.41,31.14 0 top
C24  28.4,29.15 0 top
C25  36.39,33.51 270 top
C26  36.41,30.01 90 top
C29  3.87,28.21 180 top
C30  31.2,23.15 270 bottom
C31  29,23.4 270 bottom
C32  23,5.7 90 bottom
C33  40,20.4 180 top
C34  53.6,35.4 0 top
C36  21.05,5.45 90 bottom
C38  26.4,9.4 180 bottom
CRYSTAL  33,31.8 270 top
D2  39.8,17.8 270 top
D4  15.6,45.6 270 top
IC1  16.6,28.6 180 top
L1  32.8,16.2 90 top
L3  51.8,41.6 0 top
L4  41.6,45.8 0 top
LED1  43.5,52.2 0 top
R1  12.83,19.27 270 bottom
R2  20.6,39.8 90 top
R3  67.4,17 0 top
R4  17.37,19.26 90 bottom
R5  48.8,38.8 90 top
R6  50.6,34.4 90 top
R7  22.4,39.8 90 top
R8  47.6,52.2 180 top
R9  57.2,17 180 top
R10  43.4,34.8 180 top
R11  43.4,32.6 180 top
R12  15.4,42.6 0 top
R13  19.2,37.4 90 bottom
RCA_CONNECTOR  52,7.35 0 bottom
S2  66.8,41 270 top
S3  79.8,19.2 180 bottom
SD  19.8,17.4 180 top
SMBJ6.0A  76.6,27.2 270 top
T1  39.25,30.15 90 top
T2  39.25,34.4 90 top
U3  51.8,38.4 180 top
U$1  14.6,28.6 90 bottom
U$3  10,52 0 top
U$8  30,52 0 top
U$9  57,52 0 top
U$14  77,52 0 top
U$18  34,41 0 top
U$19  78.8,10.4 0 top
U$20  46,42.8 90 top
U$21  83.2,25.8 0 top
U$22  83.2,32.8 0 top
U_DEBUG  23.2,46.4 0 top

### Tracks (layer width: path | path; a pad name or v marks a point on that pad's centre or on a via)
+5V  (via drill 0.5, 1)
  Top 0.2: IC1.102 26.2,24.4
  Top 0.8: U3.5 52.75,35.42 C34.1 | 26.2,24.4 v27.6,24.4
  Top 1: S3.3 80,21.45 | 80,21.45 S3.4 | 81.95,32.82 U$22.+ 81.93,29.2 | 81.93,29.2 U$21.+ 80,23.87 80,21.45 | 81.93,29.2 81.73,29.4 SMBJ6.0A.C 55,29.4 | 55,29.4 48.6,29.4 v45.2,26 | C34.1 52.73,31.68 55,29.4
  Bottom 0.8: v27.6,24.4 28.88,24.4 C31.1
  Bottom 1: C31.1 31.07,24.27 C30.1 33.35,24.15 C22.1 35.1,22.4 41.6,22.4 v45.2,26
+5V_HOST_PWR
  Top 0.8: L3.1 46.07,41.6 U$20.+ 44.47,40 U$18.1
DEBUG  (via drill 0.5)
  Top 0.2: IC1.89 20,15.2 20.2,15
  Top 0.4: 20.2,15 21.4,13.8 35.2,13.8 37.2,15.8 v37.2,24.2
  Bottom 0.4: v37.2,24.2 43.2,30.2 43.2,43.6 40.4,46.4 U_DEBUG.4
EMI_A00  (via drill 0.3)
  Top 0.2: IC1.76 14.8,23.6 17.8,26.6 v17.8,29.2
  Bottom 0.2: v17.8,29.2 18.4,29.2 18.6,29.4 18.6,29.6 18.4,29.8 17.8,29.8 17.6,30 17.6,30.2 17.8,30.4 18.6,30.4 18.8,30.6 18.8,30.8 18.6,31 18.6,31.2 18.8,31.4 19.8,31.4 22,33.6 22.2,33.6 22.4,33.8 U$1.29
EMI_A01  (via drill 0.3)
  Top 0.2: IC1.75 14.4,23.8 17.2,26.6 v17.2,28.6
  Bottom 0.2: v17.2,28.6 17.4,28.4 18.2,28.4 19,29.2 19,30 19.2,30.2 19.2,30.8 19.4,31 20,31 20.4,31.4 21,31.4 21.2,31.6 21.2,32.2 21.4,32.4 22.2,32.4 22.4,32.6 22.4,33.2 22.6,33.4 22.8,33.4 23.05,33.65 U$1.30
EMI_A02  (via drill 0.3)
  Top 0.2: IC1.74 14,24 16.6,26.6 v16.6,28
  Bottom 0.2: U$1.31 23.7,33.3 22.4,32 22,32 21.6,31.6 21.6,31.2 21.4,31 20.6,31 19.4,29.8 19.4,29 18.4,28 v16.6,28
EMI_A03  (via drill 0.3)
  Top 0.2: IC1.73 13.6,24.2 16,26.6 v16,27.4
  Bottom 0.2: U$1.32 24.35,33.35 18.4,27.4 v16,27.4
EMI_A04  (via drill 0.3)
  Top 0.2: IC1.72 13.2,24.4 15.2,26.4 v15.2,27
  Bottom 0.2: v15.2,27 15.4,26.8 23,26.8 24.4,25.4 24.4,23.6 24.35,23.55 U$1.35
EMI_A05  (via drill 0.3)
  Top 0.2: IC1.71 12.8,24.6 14.4,26.2 v14.4,26.8
  Bottom 0.2: v14.4,26.8 14.8,26.4 22.8,26.4 24,25.2 24,23.8 23.7,23.5 U$1.36
EMI_A06  (via drill 0.3)
  Top 0.2: IC1.70 12.4,24.8 13.6,26 v13.6,27
  Bottom 0.2: U$1.37 23.05,25.15 22.2,26 14.34,26 13.6,26.74 v13.6,27
EMI_A07  (via drill 0.3)
  Top 0.2: IC1.69 12,25 13,26 v13,26.4
  Bottom 0.2: 13,26.2 v13,26.4 13,25.8 13.2,25.6 22,25.6 22.6,25 22.6,24.8 22.2,24.4 22.2,24.2 22.6,23.8 22.6,23.6 22.4,23.4 U$1.38
EMI_A08  (via drill 0.3)
  Top 0.2: IC1.68 11.6,25.2 12.2,25.8 v12.2,26.2
  Bottom 0.2: U$1.39 21.75,23.35 22,23.6 22,23.8 21.6,24.2 21.6,24.4 21.8,24.6 21.8,24.8 21.4,25.2 16,25.2 15.6,24.8 15.4,24.8 15,25.2 14.8,25.2 14.4,24.8 14.2,24.8 13.8,25.2 13.6,25.2 13.2,24.8 13,24.8 12.2,25.6 v12.2,26.2
EMI_A09  (via drill 0.3)
  Top 0.2: IC1.67 11.2,25.8 v11.4,26
  Bottom 0.2: U$1.40 21.1,23.7 20,24.8 17.4,24.8 17,24.4 15.8,24.4 15.6,24.2 arc-180 15.2,24.2 arc180 14.8,24.2 arc-180 14.4,24.2 arc180 14,24.2 arc-180 13.6,24.2 arc180 13.2,24.2 arc-90 13,24 12.6,24 11.4,25.2 v11.4,26
EMI_A10  (via drill 0.3)
  Top 0.2: IC1.66 10.8,26.4 11,26.6 11.6,26.6 12.6,27.6 14.4,27.6 v16.4,29.6
  Bottom 0.2: U$1.28 21.75,33.95 19.6,31.8 18.6,31.8 v16.4,29.6
EMI_A11  (via drill 0.3)
  Top 0.2: IC1.65 10.4,19 11.6,17.8 12.4,17.8 13.4,16.8 v13.4,15.8
  Bottom 0.2: v13.4,15.8 13.8,16.2 18.6,16.2 20.4,18 20.4,19 20.6,19.2 arc180 20.6,19.6 arc-180 20.6,20 arc180 20.6,20.4 arc-180 20.6,20.8 arc180 20.6,21.2 20.45,21.35 U$1.41
EMI_A12  (via drill 0.3)
  Top 0.2: IC1.64 8.4,19.8 11.8,16.4 v12.8,16.4
  Bottom 0.2: v12.8,16.4 13,16.6 18.4,16.6 19.8,18 U$1.42
EMI_BA0  (via drill 0.3)
  Top 0.2: IC1.79 16,21.8 17,22.8 19.8,22.8 20.4,23.4 20.4,24.2 20,24.6 20,31.6 v19,32.6
  Bottom 0.2: U$1.26 20.45,33.85 20.2,33.6 19.4,33.6 19,33.2 v19,32.6
EMI_BA1  (via drill 0.3)
  Top 0.2: IC1.80 16.4,21.6 17.2,22.4 20,22.4 20.8,23.2 20.8,24.4 20.4,24.8 20.4,32.4 v19.8,33
  Bottom 0.2: U$1.27 21.1,33.9 20.4,33.2 20,33.2 v19.8,33
EMI_CASN  (via drill 0.3)
  Top 0.2: IC1.61 5.4,23.6 3.6,25.4 v3.2,25.4
  Bottom 0.2: v3.2,25.4 3.2,26.2 6.4,29.4 13.4,29.4 15,31 16,31 16.2,31.2 16.2,32.2 17.85,33.85 U$1.22
EMI_CE0N  (via drill 0.3)
  Top 0.2: IC1.63 4.4,22.8 v3.6,23.6
  Bottom 0.2: v3.6,23.6 4.2,24.2 4.2,26 6.8,28.6 13.8,28.6 15.4,30.2 16.4,30.2 17,30.8 17,31.8 19.15,33.95 U$1.24
  Bottom 0.4: R13.1 19.15,36.4 U$1.24
EMI_CKE  (via drill 0.3)
  Top 0.2: IC1.78 15.6,22 16.8,23.2 19.2,23.2 v19.8,23.8
  Bottom 0.2: U$1.44 18.5,23.3 18.8,23.6 19.6,23.6 v19.8,23.8
EMI_CLK  (via drill 0.3)
  Top 0.2: IC1.36 16.2,33.6 19.6,30.2 19.6,25 v18.8,24.2
  Bottom 0.2: U$1.45 17.85,23.45 18,23.6 18.2,23.6 v18.8,24.2
EMI_CLKN  (via drill 0.3)
  Top 0.2: IC1.37 16,33.2 19.2,30 19.2,25.6 v17.8,24.2
  Bottom 0.2: U$1.46 17.2,23.6 v17.8,24.2
EMI_D00  (via drill 0.3)
  Top 0.2: IC1.41 7.4,31.6 7.2,31.8 6.4,31.8 6.2,32 v6.2,32.6
  Bottom 0.2: v6.2,32.6 4.8,32.6 4.6,32.8 4.6,33.4 4.85,33.65 U$1.2
EMI_D01  (via drill 0.3)
  Top 0.2: IC1.43 7.4,30.8 7,30.4 6.2,30.4 5.6,31 v5.6,31.2
  Bottom 0.2: v5.6,31.2 5.6,31.6 6,32 6.6,32 7,32.4 7,32.8 6.15,33.65 U$1.4
EMI_D02  (via drill 0.3)
  Top 0.2: IC1.42 v6.4,31.2
  Bottom 0.2: v6.4,31.2 6.4,31 6.6,30.8 7.4,30.8 7.6,31 7.6,31.4 7.2,31.8 7.2,32 7.4,32.2 7.6,32.2 7.8,32.4 7.8,32.6 6.8,33.6 U$1.5
EMI_D03  (via drill 0.3)
  Top 0.2: IC1.44 9.4,30.4 9.6,30.6 9.6,31.2 v9.8,31.4
  Bottom 0.2: v9.8,31.4 9.6,31.6 9.2,31.6 arc-180 9.2,32 9.8,32 arc180 9.8,32.4 9.4,32.4 8.1,33.7 U$1.7
EMI_D04  (via drill 0.3)
  Top 0.2: IC1.47 10.2,29.2 10.6,29.6 v10.6,31.2
  Bottom 0.2: v10.6,31.2 10.6,32.4 9.6,33.4 9.1,33.4 8.75,33.75 U$1.8
EMI_D05  (via drill 0.3)
  Top 0.2: IC1.48 10.4,28.8 11.2,29.6 v11.2,31.8
  Bottom 0.2: U$1.10 10.05,33.65 11.2,32.5 v11.2,31.8
EMI_D06  (via drill 0.3)
  Top 0.2: IC1.49 10.6,28.4 11.8,29.6 v11.8,31.2
  Bottom 0.2: v11.8,31.2 11.8,32.6 10.7,33.7 U$1.11
EMI_D07  (via drill 0.3)
  Top 0.2: IC1.50 10.8,28 12.2,29.4 12.2,30.4 v13,31.2
  Bottom 0.2: U$1.13 12,33.8 13,32.8 v13,31.2
EMI_D08  (via drill 0.3)
  Top 0.2: IC1.51 11,27.6 v11.2,27.4
  Bottom 0.2: v11.2,27.4 11.2,26.8 10.8,26.4 10.8,25.2 12,24 U$1.54
EMI_D09  (via drill 0.3)
  Top 0.2: IC1.52 10.2,27.2 v10.4,27
  Bottom 0.2: U$1.56 10.7,24.5 10.4,24.8 v10.4,27
EMI_D10  (via drill 0.3)
  Top 0.2: IC1.54 v9.8,26.4
  Bottom 0.2: U$1.57 10.05,24.35 9.8,24.6 v9.8,26.4
EMI_D11  (via drill 0.3)
  Top 0.2: IC1.55 7.4,26 6.8,26.6 v6.6,26.6
  Bottom 0.2: U$1.59 8.75,24.65 6.8,26.6 v6.6,26.6
EMI_D12  (via drill 0.3)
  Top 0.2: IC1.57 7.4,25.2 6.8,25.8 v6.6,25.8
  Bottom 0.2: U$1.60 8.1,24.3 v6.6,25.8
EMI_D13  (via drill 0.3)
  Top 0.2: IC1.58 7.2,24.8 6.8,25.2 6,25.2 v5.8,25.4
  Bottom 0.2: U$1.62 6.8,24.6 6,25.4 v5.8,25.4
EMI_D14  (via drill 0.3)
  Top 0.2: IC1.60 6.4,24 v6.2,24.2
  Bottom 0.2: U$1.63 6.15,24.15 v6.2,24.2
EMI_D15  (via drill 0.3)
  Top 0.2: IC1.59 7,24.4 6.6,24.8 5.6,24.8 v5.4,24.6
  Bottom 0.2: U$1.65 4.85,24.05 v5.4,24.6
EMI_DQM0  (via drill 0.3)
  Top 0.2: IC1.46 9.6,29.6 v10,30
  Bottom 0.2: U$1.20 16.55,33.75 14.8,32 14.8,31.4 13.2,29.8 10.2,29.8 v10,30
EMI_DQM1  (via drill 0.3)
  Top 0.2: IC1.56 9.4,25.6 10,25 10,18.8 11.8,17 v12.2,17
  Bottom 0.2: U$1.47 16.55,21.65 16.8,21.4 18.8,21.4 19.4,20.8 19.4,18.2 18.2,17 v12.2,17
EMI_DQS0  (via drill 0.3)
  Top 0.2: IC1.39 9.4,32.4 9.8,32.8 14,32.8 v14.2,32.6
  Bottom 0.2: U$1.16 13.95,32.85 v14.2,32.6
EMI_DQS1  (via drill 0.3)
  Top 0.2: IC1.40 9.6,32 10,32.4 13.4,32.4 13.8,32 14.6,32 15,32.4 16.2,32.4 18.8,29.8 18.8,26.4 16.6,24.2 v16.6,23.8
  Bottom 0.2: U$1.51 13.95,23.35 14.2,23.6 16.4,23.6 v16.6,23.8
EMI_RASN  (via drill 0.3)
  Top 0.2: IC1.62 5,23.2 3.8,24.4 v3.2,24.4
  Bottom 0.2: v3.2,24.4 3.8,25 3.8,26.2 6.6,29 13.6,29 15.2,30.6 16.2,30.6 16.6,31 16.6,32 18.5,33.9 U$1.23
EMI_WEN  (via drill 0.3)
  Top 0.2: IC1.77 15.2,23.4 18.4,26.6 18.4,29.6 16.4,31.6 v15.6,31.6
  Bottom 0.2: v15.6,31.6 15.6,32.2 17.2,33.8 U$1.21
GND  (via drill 0.3, 0.5)
  other vias: 11.6,19 19.4,40.2 21.2,42.8 21.2,28 5.6,26.4 12,28 23.2,28 1.8,21.6 12.4,31.8 28.6,15.4
  pour Top: 1,2 86,2 86,55 1,55
  pour Bottom: 0.8,1.8 86.2,1.8 86.2,55.2 0.8,55.2
GP_CLOCK
  Top 0.2: IC1.27 12.4,37.8 8,42.2 8,42.6
  Top 0.4: 8,42.6 8,48 5.6,50.4 U$3.1
  Bottom 0.4: 25.6,50.2 6.4,50.2 5.6,51 U$3.1 | 25.6,50.2 52.6,50.2 | U$9.1 52.6,50.2 | U$8.1 25.6,50.2 | 52.6,50.2 71.8,50.2 72.6,51 U$14.1
GP_DATA_1
  Top 0.2: IC1.22 14.4,38.8 11,42.2 11,42.6
  Top 0.4: 11,42.6 11,47.2 12.8,49 56,49 57.2,50.2 76.2,50.2 77,51 U$14.3
GP_DATA_2
  Top 0.2: IC1.23 14,38.6 10.4,42.2 10.4,42.6
  Top 0.4: 10.4,42.6 10.4,47.6 12.4,49.6 55.6,49.6 57,51 U$9.3
GP_DATA_3
  Top 0.2: IC1.24 13.6,38.4 9.8,42.2 9.8,42.6
  Top 0.4: 9.8,42.6 9.8,48 12,50.2 29.2,50.2 30,51 U$8.3
GP_DATA_4
  Top 0.2: IC1.25 13.2,38.2 9.2,42.2 9.2,42.6
  Top 0.4: 9.2,42.6 9.2,51.2 U$3.3
GP_LATCH
  Top 0.2: IC1.26 12.8,38 8.6,42.2 8.6,42.6
  Top 0.4: 27.8,54 9,54 7.8,52.8 U$3.2 7.8,49.2 8.6,48.4 8.6,42.6 | 27.8,54 54.8,54 | 54.8,54 73.8,54 74.8,53 U$14.2 | U$8.2 27.8,54 | U$9.2 54.8,54
GPMI_ALE/LCD_17
  Top 0.2: IC1.20 15.2,38.6 11.6,42.2 11.6,42.6
  Top 0.4: R6.2 50.85,35.6 U3.4 50.85,37.85 51.4,38.4 53.4,38.4 54.4,39.4 54.4,42.4 48.4,48.4 13.2,48.4 11.6,46.8 11.6,42.6
HP_L
  Top 0.2: IC1.113 25.8,28.8 26.2,28.4 26.2,28.2 27,27.4 27.2,27.4
  Top 0.4: 68.35,17.45 R3.2 68.35,17.65 67.8,18.2 58.2,18.2 57.6,18.8 47.8,18.8 39.2,27.4 27.2,27.4
  Top 0.8: R3.2 68.35,15.25 RCA_CONNECTOR.AUDIO_L
HP_R
  Top 0.2: IC1.109 26,27.2 27,26.2
  Top 0.4: 55.85,17.4 R9.2 55.65,17.6 47,17.6 38.4,26.2 27,26.2
  Top 0.8: R9.2 56.25,15.23 56.13,15.23 RCA_CONNECTOR.AUDIO_R
HP_VGND
  Top 0.2: IC1.111 25.8,28 27,26.8 27.2,26.8
  Top 0.4: R9.1 58.15,17.25 57.2,18.2 47.4,18.2 38.8,26.8 27.2,26.8
  Top 0.8: RCA_CONNECTOR.AUDIO_L_GND 66.45,9.15 R3.1 66.05,17.4 58.15,17.4 R9.1 58.15,9.23 58.13,9.23 RCA_CONNECTOR.AUDIO_R_GND
N$1
  Top 0.8: D4.3 18.59,45.6 U_DEBUG.1
N$2
  Bottom 0.4: U$1.49 15.25,20.2 15.2,20.14
  Bottom 0.5: R4.2 16.05,20.11 C8.1 15.2,20.14 C14.2 12.86,20.14 R1.1
N$3
  Top 1: S3.2 80,16.95 | 80,16.95 S3.1 | U$19.1 80,14.7 80,16.95
N$5  (via drill 0.5)
  Top 0.2: IC1.101 23.6,24
  Top 0.4: 23.6,24 23,23.4 23,21.8 v24,20.8
  Bottom 0.8: C18.1 29.1,17.1 C21.1 26.16,18.4 C19.1 25.14,18.86 24,20 v24,20.8
N$6
  Top 0.2: IC1.99 26.2,23.2 26.4,23.4
  Top 0.8: 26.4,23.4 31.65,23.4 L1.P$2
N$7
  Top 0.2: IC1.5 21.2,38 | IC1.14 17.6,37.8 17.8,38 20.6,38 | 20.6,38 21.2,38 | IC1.3 22,37.8 21.8,38 21.2,38 | R2.1 20.6,38
N$8
  Top 0.2: 25.2,22.4 IC1.97 25.8,22.4 26.4,21.8
  Top 0.8: 26.4,21.8 27.2,21.8 L1.P$1
N$9
  Top 0.4: U3.3 48.85,39.7 R5.2
N$10
  Top 0.2: IC1.120 25.8,31.6 26,31.4
  Top 0.4: 26,31.4 27.27,31.4 C23.1
N$11
  Top 0.6: U3.1 52.75,41.6 L3.2
N$12
  Top 0.8: U$18.M1 U$18.M2 40.7,42.84 L4.1
N$13
  Top 0.2: IC1.117 25.8,30.4 26,30.2
  Top 0.4: 26,30.2 27.05,29.15 C24.1
N$14
  Top 0.2: IC1.7 20.4,35.8 20.6,35.6 21.6,35.6 | 21.6,35.6 22.2,35.6 22.4,35.8 IC1.2 R7.1 | IC1.4 21.6,35.6
N$15
  Top 0.8: R8.2 LED1.K
N$17  (via drill 0.5)
  Top 0.8: v46,34.8 R10.1
  Top 1: S2.3 S2.4
  Bottom 0.8: S2.4 61.6,34.8 v46,34.8
N$43
  Top 0.8: R10.2 42.45,33.4 | 42.45,33.4 R11.2 | T2.1 40.4,33.4 42.45,33.4
PWM0/DUART_RXD
  Top 0.2: IC1.125 23.6,33.6 23.2,34 23.2,35.2 24.2,36.2 24.2,36.4
  Top 0.4: 24.2,36.4 24.2,41.6 21.6,44.2 14.95,44.2 D4.2
  Top 0.8: R12.1 14.45,44.6 D4.2
PWM1/DUART_TXD
  Top 0.2: IC1.126 23.8,34 23.6,34.2 23.6,35 24.8,36.2
  Top 0.4: 24.8,36.2 24.8,42 21.93,44.87 U_DEBUG.2
SSP1_CMD  (via drill 0.3)
  Top 0.2: IC1.83 17.6,13.2 v17.4,13 | SD.3 v20.8,8
  Bottom 0.2: v17.4,13 17.4,8.8 18.2,8 v20.8,8
SSP1_DATA0
  Top 0.2: IC1.84 18,12.6 14.6,9.2 14.6,5.8 14.8,5.6 16,5.6 16.4,6 SD.7
SSP1_DATA1
  Top 0.2: 15.6,7 SD.8 15,7 15,8.8 arc-90 15.2,9 16.8,9 arc180 16.8,9.4 16,9.4 arc-90 15.8,9.6 arc-90 16,9.8 16.8,9.8 arc180 16.8,10.2 arc-143 16.6,10.6 18.4,12.4 IC1.85
SSP1_DATA2  (via drill 0.3)
  Top 0.2: IC1.86 18.8,11.8 v20.4,10.2 | v23,9 SD.1
  Bottom 0.2: v23,9 23,9.4 22.6,9.8 20.8,9.8 v20.4,10.2
SSP1_DATA3
  Top 0.2: SD.2 21.9,10.9 21.4,11.4 20.6,11.4 arc-90 20.4,11.6 arc-90 20.6,11.8 22.2,11.8 arc90 22.4,12 arc90 22.2,12.2 20.2,12.2 19.2,13.2 IC1.87
SSP1_SCK  (via drill 0.3)
  Top 0.2: IC1.90 20.4,15.8 v21.6,14.6 | v19,9 18.6,8.6 SD.5
  Bottom 0.2: v19,9 19,11.4 19.6,12 21.2,12 21.6,12.4 v21.6,14.6
USB_DM
  Top 0.2: IC1.123 26.4,32.8 26.6,33
  Top 0.4: 26.6,33 29.6,36 32.2,36 35,38.8 U$18.2
USB_DP
  Top 0.2: IC1.124 25.8,33.2 26,33.4
  Top 0.4: 26,33.4 29.4,36.8 31,36.8 33,38.8 U$18.3
VDAC1
  Top 0.2: IC1.104 26,25.2
  Top 0.4: C33.1 40.88,22.73 38,25.6 27,25.6 26.6,25.2 26,25.2
  Top 0.8: C33.1 40.9,20.38 D2.3 41.25,17.45 RCA_CONNECTOR.VIDEO_OUT
VDDIO_DRAM  (via drill 0.5)
  Top 0.2: IC1.38 7.2,32.8 | IC1.45 7.2,30 7.09,29.89 | IC1.53 7.4,26.8 7.2,27 7.2,27.2 | IC1.106 26,26
  Top 0.4: C29.1 6.19,28.21 7.2,27.2 | 7.09,29.89 5.28,29.89 4.79,29.4 | 7.2,32.8 6.6,33.4 4.93,33.4 arc90 C13.1 | 26,26 v26.2,26
  Top 0.5: C29.1 4.79,28.25 4.79,29.4 C9.1 4.79,33.25 C13.1 4.8,33.31 | C29.1 4.75,27.95 | v5.2,20.4 4.6,20.4 2.2,22.8 2.2,25.8 2.6,26.2 3.6,26.2 4.75,27.34 C29.1 | 4.93,33.4 3.2,35.13 v3.2,35.2
  Bottom 0.4: U$1.1 4.2,36.16 C11.1 | U$1.3 5.5,36.33 C3.1 | U$1.18 15.25,36.58 arc90 C5.1 | U$1.55 11.35,21.55 11,21.2 10.2,21.2 9.91,20.91 9.88,20.91 | U$1.33 25,36.34 C4.1 | U$1.9 9.4,36.3 C2.1 | U$1.15 13.3,36.34 C1.1 | U$1.61 7.45,21.07 C6.1
  Bottom 0.5: C14.1 12.86,18.39 R1.2 | R1.2 12.81,18.4 | R1.2 12.61,18.2 11.2,18.2 10.6,18.8 10.6,20.2 9.88,20.91 C7.1 9.05,20.93 C6.1 6.54,20.93 6,20.4 v5.2,20.4 | v3.2,35.2 3.2,35.74 C11.1 C3.1 9.31,36.45 C2.1 9.51,36.41 C1.1 15.09,36.41 15.17,36.34 arc90 C5.1 16.39,36.4 18.35,38.35 R13.2 20.05,38.35 22.02,36.38 C4.1 25.62,36.38 27,35 C12.1 27,26.8 v26.2,26
VDDIO_P(3.3V)  (via drill 0.5)
  Top 0.2: 16,37.98 IC1.18 16,35.6 | 22.4,19 IC1.95 22.4,21.8 | 21.2,21.8 IC1.92 21.2,19.2 21.4,19
  Top 0.4: 21.2,21.8 21.8,22.4 22.4,21.8 | 16,37.98 16.29,38.27 16.29,39.22 C10.1
  Top 0.5: 21.8,22.4 21.8,23.8 22.2,24.2 22.2,33.2 21,34.4 18.8,34.4 18.2,35 16.6,35 16,35.6
  Top 0.8: C10.1 16.36,39.33 C20.1 16.36,42.59 R12.2 19.4,42.6 20.6,41.4 R2.2 | v23.4,19 22.4,19 21.4,19 | v19.8,4.6 19.7,4.7 SD.4 | D2.2 38.7,11.7 v37.4,10.4 | U$14.5 81.4,51.94 81.4,50.6 75.05,44.25 S2.1
  Top 1: S2.1 S2.2
  Bottom 0.8: U$3.5 16.34,54 34.34,54 | 34.34,54 U$8.5 | U$9.5 61.34,54 | 61.34,54 42.2,54 | 42.2,54 34.34,54 | 61.34,54 80.6,54 81.4,53.2 81.4,52.06 U$14.5 | v23.4,19 23.4,18 C15.1 | C15.1 | C15.1 C16.1 24.9,14.46 C17.1 C38.1 24.9,8 | 24.9,8 24.9,5.3 24.3,4.7 C32.1 22.88,4.58 C36.1 21.02,4.6 v19.8,4.6 | 25,8 24.9,8 | LED1.A 42.23,53.97 42.2,54
  Bottom 1: 25,8 26.2,6.8 33.8,6.8 v37.4,10.4 41.8,10.4 41.8,10.5 S2.2
XTALI
  Top 0.2: IC1.122 26.8,32.4 27.6,33.2 27.8,33.2
  Top 0.4: 27.8,33.2 31.99,33.2 CRYSTAL.1
  Top 0.8: T2.3 36.41,34.4 C25.1 33.17,34.38 CRYSTAL.1
XTALO
  Top 0.2: IC1.121 27,32 27.6,32.6 27.8,32.6
  Top 0.4: 27.8,32.6 30.6,32.6 33,30.2 CRYSTAL.2
  Top 0.8: CRYSTAL.2 33.25,29.14 C26.1 36.42,29.15 37.15,29.15 T1.3